# Altium schematic sheet LCD_Button.SchDoc
size A4; SheetNumber: 3; SheetTotal: 9
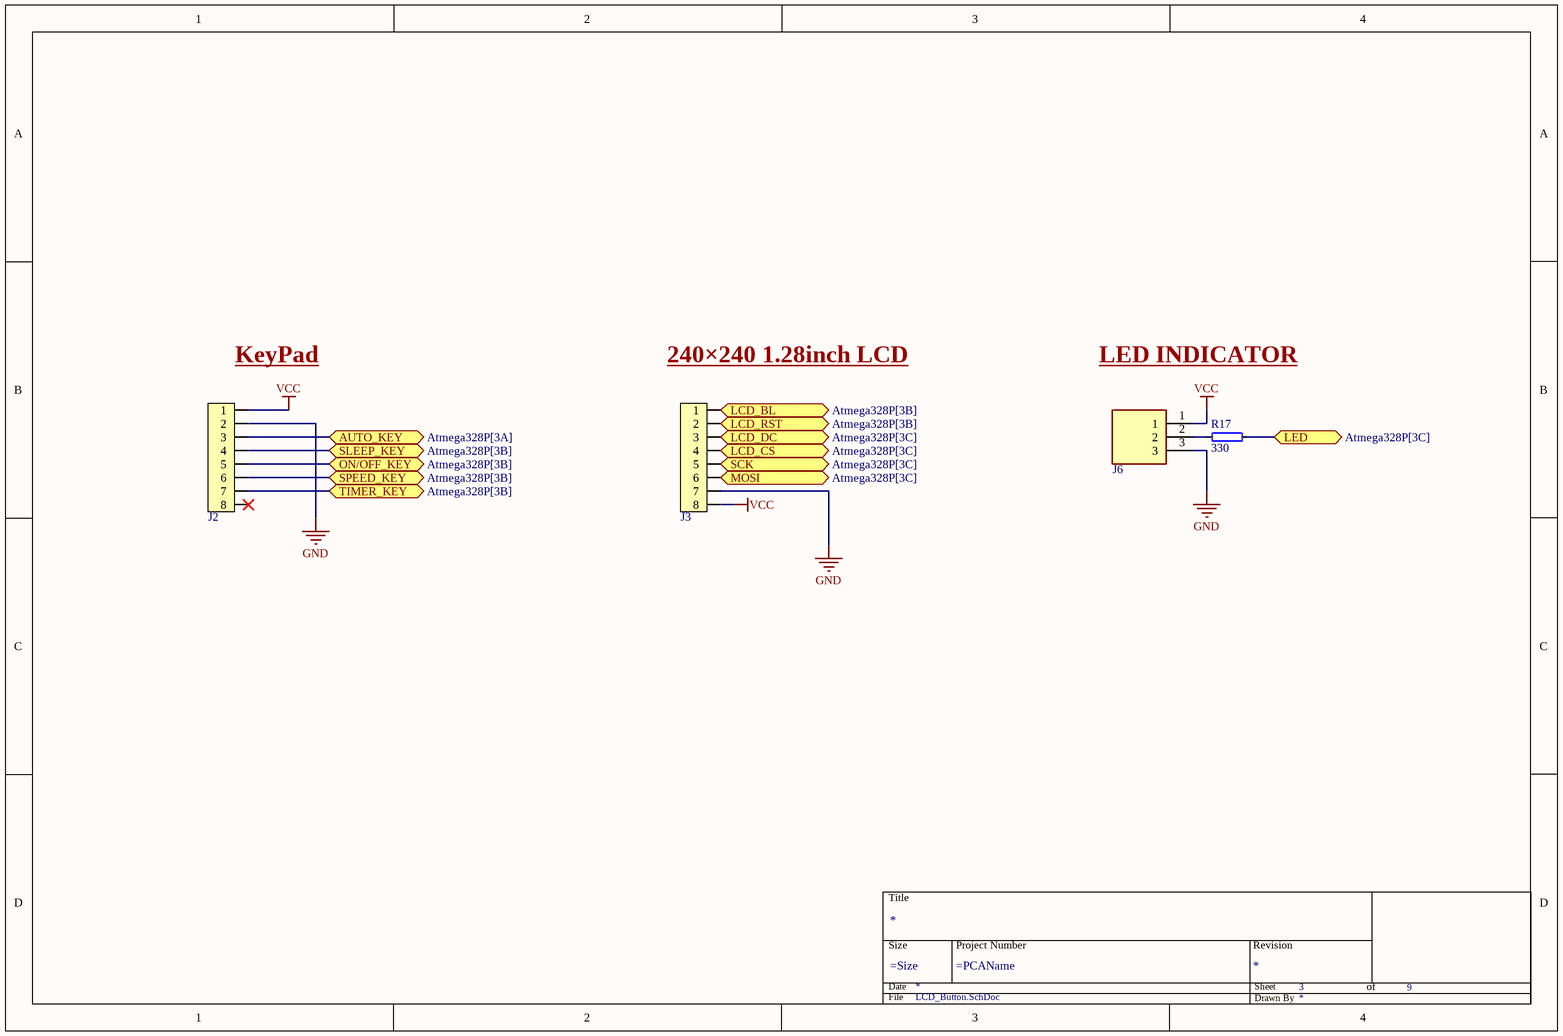
[diagram p0: LCD_Button.SchDoc]

## Parts
*  Title Block  (value not drawn)  (graphical)
J2  8way Connector  [TE_640455-8]  (value not drawn)
J3  8way Connector  [TE_640455-8]  (value not drawn)
J6  CONN HEADER VERT 3POS 2.5MM  [JST_B3B-XH-A(LF)(SN)]  (value not drawn)
R17  330  [RESC2012X65N]

## Ports
AUTO_KEY (bidir, see Atmega328P[3A]), LCD_BL (bidir, see Atmega328P[3B]), LCD_CS (bidir, see Atmega328P[3C]), LCD_DC (bidir, see Atmega328P[3C]), LCD_RST (bidir, see Atmega328P[3B]), LED (bidir, see Atmega328P[3C]), MOSI (bidir, see Atmega328P[3C]), ON/OFF_KEY (bidir, see Atmega328P[3B]), SCK (bidir, see Atmega328P[3C]), SLEEP_KEY (bidir, see Atmega328P[3B]), SPEED_KEY (bidir, see Atmega328P[3B]), TIMER_KEY (bidir, see Atmega328P[3B])

## Nets
GND: J2.2 J3.7 J6.3
VCC: J2.1 J3.8 J6.1
AUTO_KEY: J2.3 ; port AUTO_KEY
LCD_BL: J3.1 ; port LCD_BL
LCD_CS: J3.4 ; port LCD_CS
LCD_DC: J3.3 ; port LCD_DC
LCD_RST: J3.2 ; port LCD_RST
LED: R17.1 ; port LED
MOSI: J3.6 ; port MOSI
ON/OFF_KEY: J2.5 ; port ON/OFF_KEY
SCK: J3.5 ; port SCK
SLEEP_KEY: J2.4 ; port SLEEP_KEY
SPEED_KEY: J2.6 ; port SPEED_KEY
TIMER_KEY: J2.7 ; port TIMER_KEY
NetJ6_2: J6.2 R17.2

Not connected (* = marked no-connect by the designer): J2 8*

## Notes on the sheet
- (near J2) KeyPad
- (near J3) 240×240 1.28inch LCD
- LED INDICATOR
- (in symbol Title Block) Title; Size; Project Number; Revision; Date; Sheet; of; File; Drawn By

## Library data of the parts
J2 J3 = JST 8Way: 6Way Right Angle JST-XH connector Male 2.54mm Pitch; Part Number: JST-XH; Manufacturer Part Number: JST-XH; Pin Count: 6; Publisher: Metal Circuits; Value: 8way Connector
J6 = B3B-XH-A(LF)(SN): Connector Header Through Hole 3 position 0.098" (2.50mm); Manufacturer: JST Sales America Inc.; Part Number: B3B-XH-A(LF)(SN); Manufacturer Part Number: B3B-XH-A(LF)(SN); Pin Count: 3; Publisher: Metal Circuits; Value: CONN HEADER VERT 3POS 2.5MM; HelpURL: https://www.jst-mfg.com/product/pdf/eng/eXH.pdf; Supplier 1: Digi-Key; Supplier Part Number 1: 455-2248-ND
R17 = RES_0805: RES SMD 1% 1/10W 0805; Part Number: RES_0805; Pin Count: 2; Publisher: Metal Circuits; Value: 330; FootPrint Doc: 0805